# EAGLE schematic counterMeter (EAGLE 6.4)
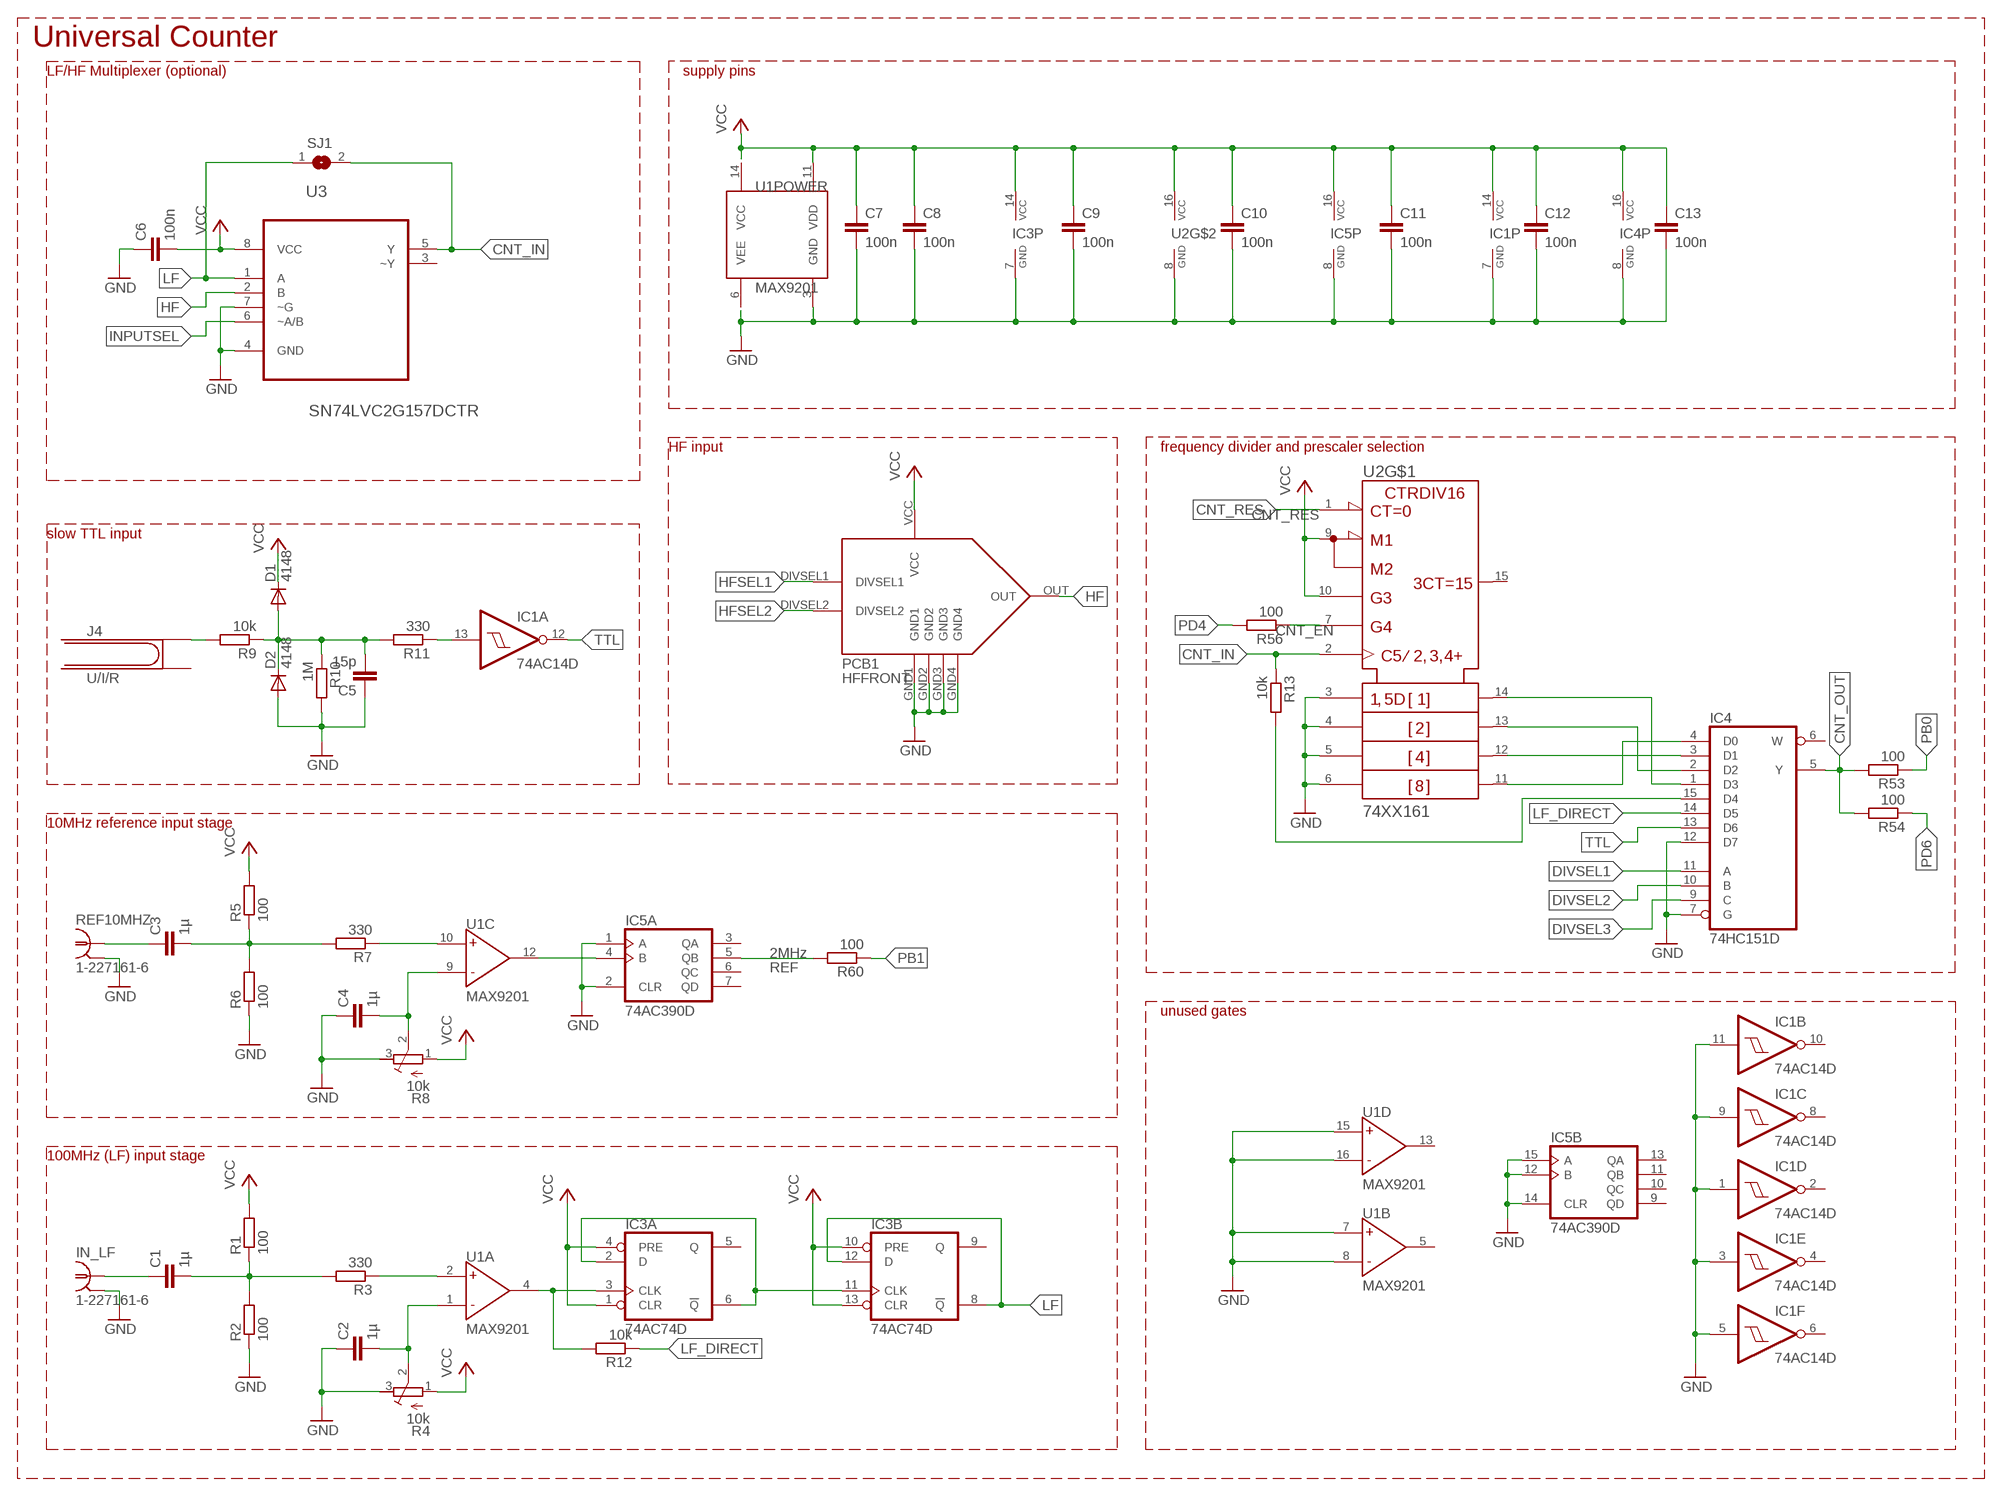
[diagram p0: schematic, sheet 1, part 1 of 2]
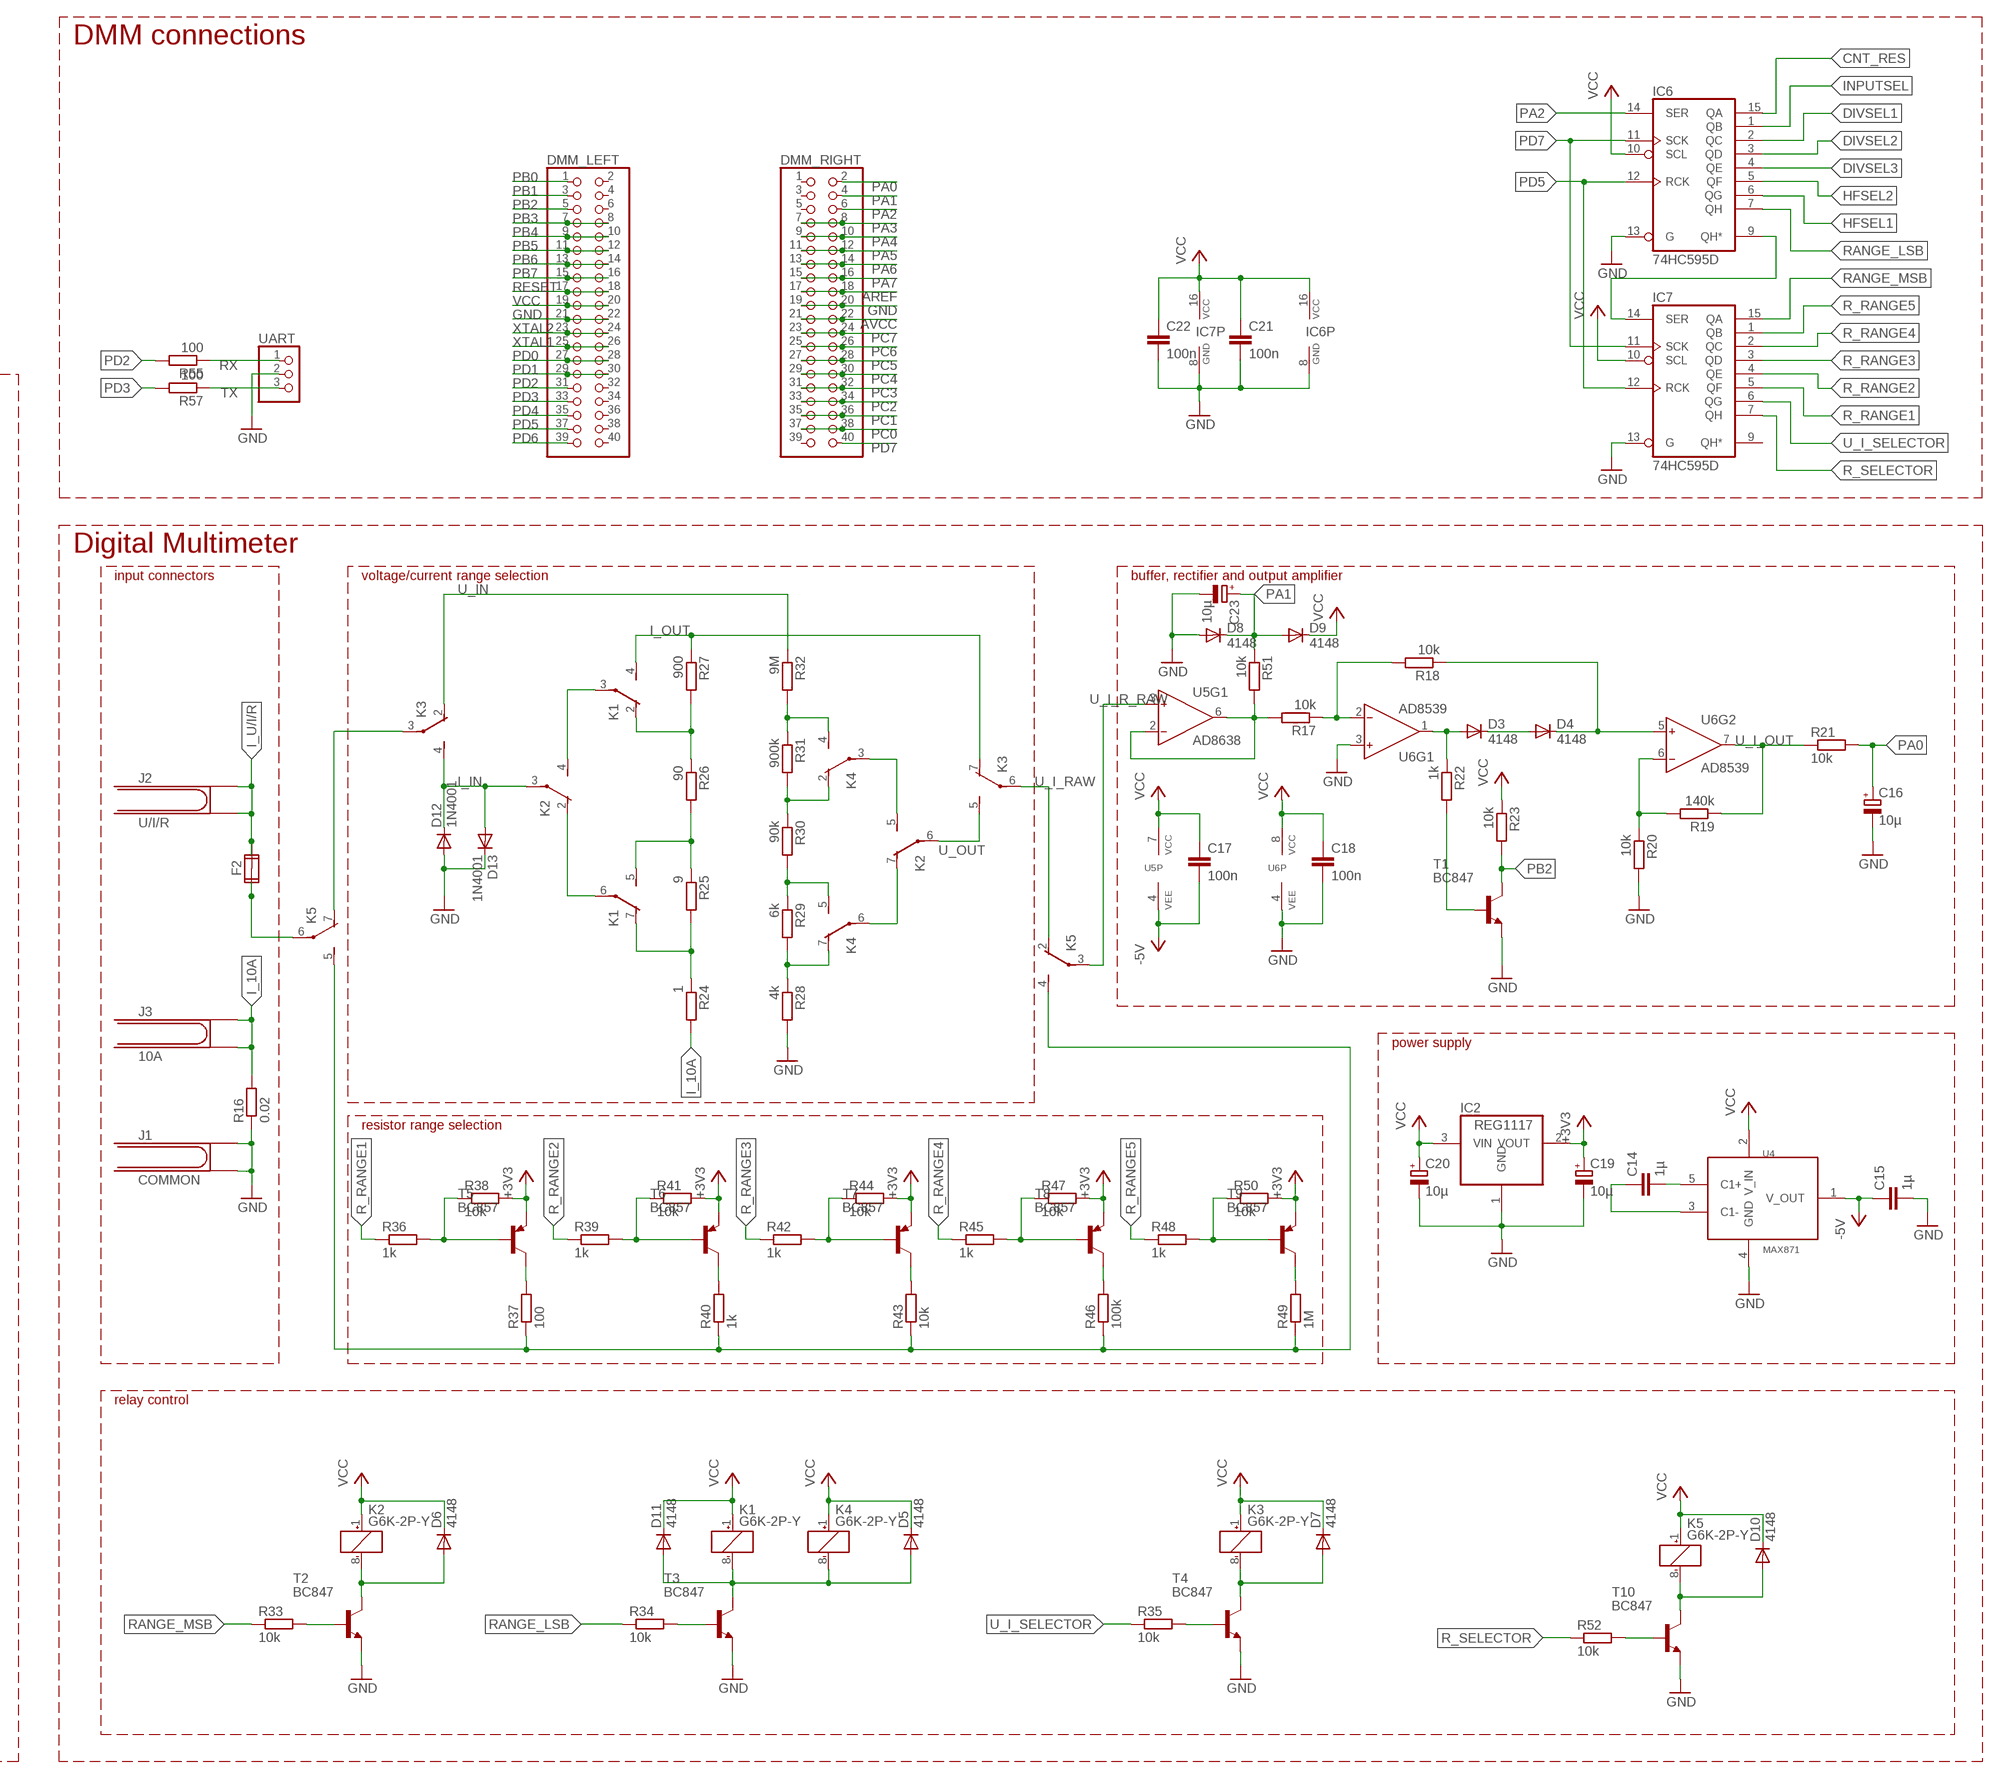
[diagram p1: schematic, sheet 1, part 2 of 2]

## Parts
C1  1µ  C-EUC0603  [C0603]
C2  1µ  C-EUC0603  [C0603]
C3  1µ  C-EUC0603  [C0603]
C4  1µ  C-EUC0603  [C0603]
C5  15p  C-EUC0603  [C0603]
C6  100n  C-EUC0603  [C0603]
C7  100n  C-EUC0603  [C0603]
C8  100n  C-EUC0603  [C0603]
C9  100n  C-EUC0603  [C0603]
C10  100n  C-EUC0603  [C0603]
C11  100n  C-EUC0603  [C0603]
C12  100n  C-EUC0603  [C0603]
C13  100n  C-EUC0603  [C0603]
C14  1µ  C-EUC0603  [C0603]
C15  1µ  C-EUC0603  [C0603]
C16  10µ  CPOL-EUE2-5  [E2-5]
C17  100n  C-EUC0603  [C0603]
C18  100n  C-EUC0603  [C0603]
C19  10µ  CPOL-EUE2-5  [E2-5]
C20  10µ  CPOL-EUE2-5  [E2-5]
C21  100n  C-EUC0603  [C0603]
C22  100n  C-EUC0603  [C0603]
C23  10µ  CPOL-EUE2-5  [E2-5]
D1  4148  DIODE-SOD323-W  [SOD323-W]
D2  4148  DIODE-SOD323-W  [SOD323-W]
D3  4148  DIODE-SOD323-W  [SOD323-W]
D4  4148  DIODE-SOD323-W  [SOD323-W]
D5  4148  DIODE-SOD323-W  [SOD323-W]
D6  4148  DIODE-SOD323-W  [SOD323-W]
D7  4148  DIODE-SOD323-W  [SOD323-W]
D8  4148  DIODE-SOD323-W  [SOD323-W]
D9  4148  DIODE-SOD323-W  [SOD323-W]
D10  4148  DIODE-SOD323-W  [SOD323-W]
D11  4148  DIODE-SOD323-W  [SOD323-W]
D12  1N4001  1N4004  [DO41-10]
D13  1N4001  1N4004  [DO41-10]
DMM_LEFT  PINHD-2X20  [2X20]
DMM_RIGHT  PINHD-2X20  [2X20]
F2  FUSE2P  [FUSE1]
IC1  74AC14D  [SO14]
IC2  REG1117  [SOT223]
IC3  74AC74D  [SO14]
IC4  74HC151D  [SO16]
IC5  74AC390D  [SO16]
IC6  74HC595D  [SO16]
IC7  74HC595D  [SO16]
IN_LF  1-227161-6  [AMP_227161]
J1  COMMON  4MMJACK  [4MMJACK]
J2  U/I/R  4MMJACK  [4MMJACK]
J3  10A  4MMJACK  [4MMJACK]
J4  U/I/R  4MMJACK  [4MMJACK]
K1  G6K-2P-Y  [G6K-2P-Y]
K2  G6K-2P-Y  [G6K-2P-Y]
K3  G6K-2P-Y  [G6K-2P-Y]
K4  G6K-2P-Y  [G6K-2P-Y]
K5  G6K-2P-Y  [G6K-2P-Y]
PCB1  HFFRONT  [HFFRONT]
R1  100  R-EU_R0603  [R0603]
R2  100  R-EU_R0603  [R0603]
R3  330  R-EU_R0603  [R0603]
R4  10k  R-TRIMM64W  [RTRIM64W]
R5  100  R-EU_R0603  [R0603]
R6  100  R-EU_R0603  [R0603]
R7  330  R-EU_R0603  [R0603]
R8  10k  R-TRIMM64W  [RTRIM64W]
R9  10k  R-EU_R0603  [R0603]
R10  1M  R-EU_R0603  [R0603]
R11  330  R-EU_R0603  [R0603]
R12  10k  R-EU_R0603  [R0603]
R13  10k  R-EU_R0603  [R0603]
R16  0.02  R-EU_R2512  [R2512]
R17  10k  R-EU_R0603  [R0603]
R18  10k  R-EU_R0603  [R0603]
R19  140k  R-EU_R0603  [R0603]
R20  10k  R-EU_R0603  [R0603]
R21  10k  R-EU_R0603  [R0603]
R22  1k  R-EU_R0603  [R0603]
R23  10k  R-EU_R0603  [R0603]
R24  1  R-EU_R0603  [R0603]
R25  9  R-EU_R0603  [R0603]
R26  90  R-EU_R0603  [R0603]
R27  900  R-EU_R0603  [R0603]
R28  4k  R-EU_R0603  [R0603]
R29  6k  R-EU_R0603  [R0603]
R30  90k  R-EU_R0603  [R0603]
R31  900k  R-EU_R0603  [R0603]
R32  9M  R-EU_R0603  [R0603]
R33  10k  R-EU_R0603  [R0603]
R34  10k  R-EU_R0603  [R0603]
R35  10k  R-EU_R0603  [R0603]
R36  1k  R-EU_R0603  [R0603]
R37  100  R-EU_R0603  [R0603]
R38  10k  R-EU_R0603  [R0603]
R39  1k  R-EU_R0603  [R0603]
R40  1k  R-EU_R0603  [R0603]
R41  10k  R-EU_R0603  [R0603]
R42  1k  R-EU_R0603  [R0603]
R43  10k  R-EU_R0603  [R0603]
R44  10k  R-EU_R0603  [R0603]
R45  1k  R-EU_R0603  [R0603]
R46  100k  R-EU_R0603  [R0603]
R47  10k  R-EU_R0603  [R0603]
R48  1k  R-EU_R0603  [R0603]
R49  1M  R-EU_R0603  [R0603]
R50  10k  R-EU_R0603  [R0603]
R51  10k  R-EU_R0603  [R0603]
R52  10k  R-EU_R0603  [R0603]
R53  100  R-EU_R0603  [R0603]
R54  100  R-EU_R0603  [R0603]
R55  100  R-EU_R0603  [R0603]
R56  100  R-EU_R0603  [R0603]
R57  100  R-EU_R0603  [R0603]
R60  100  R-EU_R0603  [R0603]
REF10MHZ  1-227161-6  [AMP_227161]
SJ1  SJ  [SJ]
T1  BC847  [SOT23]
T2  BC847  [SOT23]
T3  BC847  [SOT23]
T4  BC847  [SOT23]
T5  BC857  BC857C-PNP-SOT23-BEC  [SOT23-BEC]
T6  BC857  BC857C-PNP-SOT23-BEC  [SOT23-BEC]
T7  BC857  BC857C-PNP-SOT23-BEC  [SOT23-BEC]
T8  BC857  BC857C-PNP-SOT23-BEC  [SOT23-BEC]
T9  BC857  BC857C-PNP-SOT23-BEC  [SOT23-BEC]
T10  BC847  [SOT23]
U1  MAX9201  [SOIC16]
U2  74XX161  [SOIC16]
U3  SN74LVC2G157DCTR  [SOP65P400X130-8N]
U4  MAX871  [SOT23-5]
U5  AD8638  [SOIC8]
U6  AD8539  [SOIC8]
UART  PINHD-1X3  [1X03]

## Nets
+3V3: C19.+ IC2.2(VOUT) R38.2 R41.2 R44.2 R47.2 R50.2 T5.E T6.E T7.E T8.E T9.E
-5V: C15.1 C17.2 U4.1(V_OUT) U5.4(P:VEE)
AREF: DMM_RIGHT.17 DMM_RIGHT.18
AVCC: DMM_RIGHT.21 DMM_RIGHT.22
CNT_EN: R56.1 U2.7(ENP)
CNT_IN: R13.1 SJ1.2 U2.2(CLK) U3.5(Y)
CNT_IN_: IC4.15(D4) R13.2
CNT_OUT: IC4.5(Y) R53.2 R54.2
CNT_RES: IC6.15(QA) U2.1(!CLR)
DIVSEL1: IC4.11(A) IC6.2(QC)
DIVSEL2: IC4.10(B) IC6.3(QD)
DIVSEL3: IC4.9(C) IC6.4(QE)
GND: C2.1 C4.1 C5.1 C6.1 C7.2 C8.2 C9.2 C10.2 C11.2 C12.2 C13.2 C15.2 C16.- C18.2 C19.- C20.- C21.2 C22.2 C23.- D2.A D8.A D12.A D13.C DMM_LEFT.21 DMM_LEFT.22 DMM_RIGHT.19 DMM_RIGHT.20 IC1.1(D:I) IC1.3(E:I) IC1.5(F:I) IC1.7(P:GND) IC1.9(C:I) IC1.11(B:I) IC2.1(GND) IC3.7(P:GND) IC4.7(G) IC4.8(GND) IC4.12(D7) IC5.1(A:A) IC5.2(A:CLR) IC5.8(P:GND) IC5.12(B:B) IC5.14(B:CLR) IC5.15(B:A) IC6.8(GND) IC6.13(G) IC7.8(GND) IC7.13(G) IN_LF.2 J1.1@1 J1.1@2 PCB1.GND1 PCB1.GND2 PCB1.GND3 PCB1.GND4 R2.1 R4.3(A) R6.1 R8.3(A) R10.2 R16.1 R20.2 R28.2 REF10MHZ.2 T1.2(E) T2.2(E) T3.2(E) T4.2(E) T10.2(E) U1.3(POWER:GND) U1.6(POWER:VEE) U1.7(B:IN+) U1.8(B:IN-) U1.15(D:IN+) U1.16(D:IN-) U2.3(A) U2.4(B) U2.5(C) U2.6(D) U2.8(GND) U3.4(GND) U3.7(~G) U4.4(GND) U6.3(IN+) U6.4(P:VEE) UART.2
HF: PCB1.OUT U3.2(B)
HFSEL1: IC6.6(QG) PCB1.DIVSEL1
HFSEL2: IC6.5(QF) PCB1.DIVSEL2
I_10A: J3.1@1 J3.1@2 R16.2 R24.2
I_IN: D12.C D13.A K2.3(2:P) K3.4(2:S)
I_OUT: K1.4(2:S) K3.7(3:O) R27.1
I_U/I/R: F2.2A F2.2B J2.1@1 J2.1@2
INPUTSEL: IC6.1(QB) U3.6(~A/B)
LF: IC3.8(B:!Q) IC3.12(B:D) SJ1.1 U3.1(A)
LF_DIRECT: IC4.14(D5) R12.1
LF_SIG: IC3.3(A:CLK) R12.2 U1.4(A:OUT)
N$1: C2.2 R4.2(S) U1.1(A:IN-)
N$2: R3.1 U1.2(A:IN+)
N$3: C1.2 R1.1 R2.2 R3.2
N$4: C1.1 IN_LF.1
N$5: C4.2 R8.2(S) U1.9(C:IN-)
N$6: R7.1 U1.10(C:IN+)
N$7: C3.2 R5.1 R6.2 R7.2
N$8: C3.1 REF10MHZ.1
N$9: J4.1@1 R9.2
N$10: C5.2 D1.A D2.C R9.1 R10.1 R11.2
N$11: IC1.13(A:I) R11.1
N$12: K4.7(3:O) R28.1 R29.2
N$13: IC5.4(A:B) U1.12(C:OUT)
N$14: IC4.1(D3) U2.14(QA)
N$15: K1.3(2:P) K2.4(2:S)
N$16: IC4.2(D2) U2.13(QB)
N$17: IC4.3(D1) U2.12(QC)
N$18: IC4.4(D0) U2.11(QD)
N$19: F2.1A F2.1B K5.6(3:P)
N$24: C14.2 U4.5(C1+)
N$25: C14.1 U4.3(C1-)
N$26: D3.A R22.1 U6.1(OUT)
N$27: D4.C R18.1 U6.5(IN+)
N$28: R19.2 R20.1 U6.6(IN-)
N$29: IC6.9(QH*) IC7.14(SER)
N$30: R17.1 R18.2 U6.2(IN-)
N$31: R17.2 R51.2 U5.2(IN-) U5.6(OUT)
N$32: D3.C D4.A
N$33: R22.2 T1.1(B)
N$34: K1.7(3:O) R24.1 R25.2
N$35: K1.5(3:S) R25.1 R26.2
N$36: K1.2(2:O) R26.1 R27.2
N$37: K1.6(3:P) K2.2(2:O)
N$38: K4.5(3:S) R29.1 R30.2
N$39: K4.2(2:O) R30.1 R31.2
N$40: K4.4(2:S) R31.1 R32.2
N$41: K2.5(3:S) K4.3(2:P)
N$42: K2.7(3:O) K4.6(3:P)
N$43: D6.A K2.8(1:-) T2.3(C)
N$44: R33.2 T2.1(B)
N$45: D5.A D11.A K1.8(1:-) K4.8(1:-) T3.3(C)
N$46: R34.2 T3.1(B)
N$47: R35.2 T4.1(B)
N$48: D7.A K3.8(1:-) T4.3(C)
N$49: R36.2 R38.1 T5.B
N$50: R37.2 T5.C
N$51: K3.3(2:P) K5.7(3:O)
N$52: IC3.2(A:D) IC3.6(A:!Q) IC3.11(B:CLK)
N$53: R39.2 R41.1 T6.B
N$54: R40.2 T6.C
N$56: R42.2 R44.1 T7.B
N$57: R43.2 T7.C
N$59: R45.2 R47.1 T8.B
N$60: R46.2 T8.C
N$62: R48.2 R50.1 T9.B
N$63: R49.2 T9.C
N$65: K5.4(2:S) K5.5(3:S) R37.1 R40.1 R43.1 R46.1 R49.1
N$66: R52.2 T10.1(B)
N$67: D10.A K5.8(1:-) T10.3(C)
PA0: C16.+ DMM_RIGHT.2 R21.2
PA1: C23.+ D8.C D9.A DMM_RIGHT.4 R51.1
PA2: DMM_RIGHT.6 IC6.14(SER)
PA3: DMM_RIGHT.7 DMM_RIGHT.8
PA4: DMM_RIGHT.9 DMM_RIGHT.10
PA5: DMM_RIGHT.11 DMM_RIGHT.12
PA6: DMM_RIGHT.13 DMM_RIGHT.14
PA7: DMM_RIGHT.15 DMM_RIGHT.16
PB0: DMM_LEFT.1 R53.1
PB1: DMM_LEFT.3 R60.1
PB2: DMM_LEFT.5 R23.2 T1.3(C)
PB3: DMM_LEFT.7 DMM_LEFT.8
PB4: DMM_LEFT.9 DMM_LEFT.10
PB5: DMM_LEFT.11 DMM_LEFT.12
PB6: DMM_LEFT.13 DMM_LEFT.14
PB7: DMM_LEFT.15 DMM_LEFT.16
PC0: DMM_RIGHT.37 DMM_RIGHT.38
PC1: DMM_RIGHT.35 DMM_RIGHT.36
PC2: DMM_RIGHT.33 DMM_RIGHT.34
PC3: DMM_RIGHT.31 DMM_RIGHT.32
PC4: DMM_RIGHT.29 DMM_RIGHT.30
PC5: DMM_RIGHT.27 DMM_RIGHT.28
PC6: DMM_RIGHT.25 DMM_RIGHT.26
PC7: DMM_RIGHT.23 DMM_RIGHT.24
PD0: DMM_LEFT.27 DMM_LEFT.28
PD1: DMM_LEFT.29 DMM_LEFT.30
PD2: DMM_LEFT.31 R55.2
PD3: DMM_LEFT.33 R57.2
PD4: DMM_LEFT.35 R56.2
PD5: DMM_LEFT.37 IC6.12(RCK) IC7.12(RCK)
PD6: DMM_LEFT.39 R54.1
PD7: DMM_RIGHT.40 IC6.11(SCK) IC7.11(SCK)
R_RANGE1: IC7.5(QF) R36.1
R_RANGE2: IC7.4(QE) R39.1
R_RANGE3: IC7.3(QD) R42.1
R_RANGE4: IC7.2(QC) R45.1
R_RANGE5: IC7.1(QB) R48.1
R_SELECTOR: IC7.7(QH) R52.1
RANGE_LSB: IC6.7(QH) R34.1
RANGE_MSB: IC7.15(QA) R33.1
REF: IC5.5(A:QB) R60.2
RESET: DMM_LEFT.17 DMM_LEFT.18
RX: R55.1 UART.1
TTL: IC1.12(A:O) IC4.13(D6)
TX: R57.1 UART.3
U_I_OUT: R19.1 R21.1 U6.7(OUT)
U_I_R_RAW: K5.3(2:P) U5.3(IN+)
U_I_RAW: K3.6(3:P) K5.2(2:O)
U_I_SELECTOR: IC7.6(QG) R35.1
U_IN: K3.2(2:O) R32.1
U_OUT: K2.6(3:P) K3.5(3:S)
VCC: C6.2 C7.1 C8.1 C9.1 C10.1 C11.1 C12.1 C13.1 C17.1 C18.1 C20.+ C21.1 C22.1 D1.C D5.C D6.C D7.C D9.C D10.C D11.C DMM_LEFT.19 DMM_LEFT.20 IC1.14(P:VCC) IC2.3(VIN) IC3.1(A:CLR) IC3.4(A:PRE) IC3.10(B:PRE) IC3.13(B:CLR) IC3.14(P:VCC) IC4.16(VCC) IC5.16(P:VCC) IC6.10(SCL) IC6.16(VCC) IC7.10(SCL) IC7.16(VCC) K1.1(1:+) K2.1(1:+) K3.1(1:+) K4.1(1:+) K5.1(1:+) PCB1.VCC R1.2 R4.1(E) R5.2 R8.1(E) R23.1 U1.11(POWER:VDD) U1.14(POWER:VCC) U2.9(!LOAD) U2.10(ENT) U2.16(VCC) U3.8(VCC) U4.2(V_IN) U5.7(P:VCC) U6.8(P:VCC)
XTAL1: DMM_LEFT.25 DMM_LEFT.26
XTAL2: DMM_LEFT.23 DMM_LEFT.24
Unconnected: DMM_LEFT.2 DMM_LEFT.4 DMM_LEFT.6 DMM_LEFT.32 DMM_LEFT.34 DMM_LEFT.36 DMM_LEFT.38 DMM_LEFT.40 DMM_RIGHT.1 DMM_RIGHT.3 DMM_RIGHT.5 DMM_RIGHT.39 IC1.2(D:O) IC1.4(E:O) IC1.6(F:O) IC1.8(C:O) IC1.10(B:O) IC3.5(A:Q) IC3.9(B:Q) IC4.6(W) IC5.3(A:QA) IC5.6(A:QC) IC5.7(A:QD) IC5.9(B:QD) IC5.10(B:QC) IC5.11(B:QB) IC5.13(B:QA) IC7.9(QH*) J4.1@2 U1.5(B:OUT) U1.13(D:OUT) U2.15(RCO) U3.3(~Y)

## Notes on the sheet
- DMM connections
- Universal Counter
- LF/HF Multiplexer (optional) | supply pins
- Digital Multimeter
- input connectors | voltage/current range selection | buffer, rectifier and output amplifier
- HF input | frequency divider and prescaler selection
- slow TTL input
- power supply
- resistor range selection
- 10MHz reference input stage
- 2MHz
- unused gates
- relay control
- 100MHz (LF) input stage

## Library data of the parts
C1-C15 C17 C18 C21 C22 = rcl:C-EU: CAPACITOR, European symbol
C16 C19 C20 C23 = rcl:CPOL-EU: POLARIZED CAPACITOR, European symbol
D1-D11 = diode:DIODE-: DIODE
D12 D13 = diode:1N4004: DIODE general purpose rectifier, 1 A
DMM_LEFT DMM_RIGHT = pinhead:PINHD-2X20: PIN HEADER
F2 = special:FUSE2P: FUSE 5 x 20 mm
IC1 = 74xx-eu:74*14: Hex schmitt trigger INVERTER
IC2 = burr-brown:REG1117: 800mA and 1A Low Dropout (LDO) Positive Regulator 1.8V, 2.5V, 2.85V, 3.3V, 5V, and Adj; MPN: REG1117; OC_FARNELL: 1097566; OC_NEWARK: 14P6981
IC3 = 74xx-eu:74*74: Dual D type positive edge triggered FLIP FLOP, preset and clear
IC4 = 74xx-eu:74*151: Data SELECTOR/MULTIPLEXER
IC5 = 74xx-eu:74*390: Dual 4-bit decade and binary COUNTER
IC6 IC7 = 74xx-eu:74*595: 8-bit SHIFT REGISTER, output latch
IN_LF REF10MHZ = con-coax:?227161*: JACK, RIGHT ANGLE, 50 OHM, PCB, BNC Source: amp_227161.pdf; MF: TYCO ELECTRONICS; MPN: 1-227161-6; OC_FARNELL: unknown; OC_NEWARK: 09H7854
J1-J4 = dmm:4MMJACK
K1-K5 = relay:G6K: Low Signal Relay oeiwcsnts1.omron.com/.. D20G6K0100.pdf; MF: OMRON COMPONENTS USA; MPN: G6K-2P-Y DC12; OC_FARNELL: 3937276; OC_NEWARK: 34C3464
PCB1 = dmm:HFFRONT
R1-R3 R5-R7 R9-R13 R16-R57 R60 = resistor:R-EU_: RESISTOR, European symbol
R4 R8 = resistor:R-TRIMM: Trimm resistor
SJ1 = jumper:SJ: SMD solder JUMPER
T1-T4 T10 = transistor:BC847: NPN TRANSISTOR
T5-T9 = transistor:*-PNP-: PNP Transistror
U1 = dmm:MAX9201
U2 = dmm:74XX161
U3 = dmm:SN74LVC2G157DCTR: SINGLE 2-LINE TO 1-LINE DATA SELECTOR/MULTIPLEXER; MPN: SN74LVC2G157DCTR; OC_FARNELL: 1287414; OC_NEWARK: 76C4205; PACKAGE: SOP-8; SUPPLIER: Texas Instruments
U4 = dmm:MAX871
U5 = dmm:AD8638
U6 = dmm:AD8539
UART = pinhead:PINHD-1X3: PIN HEADER